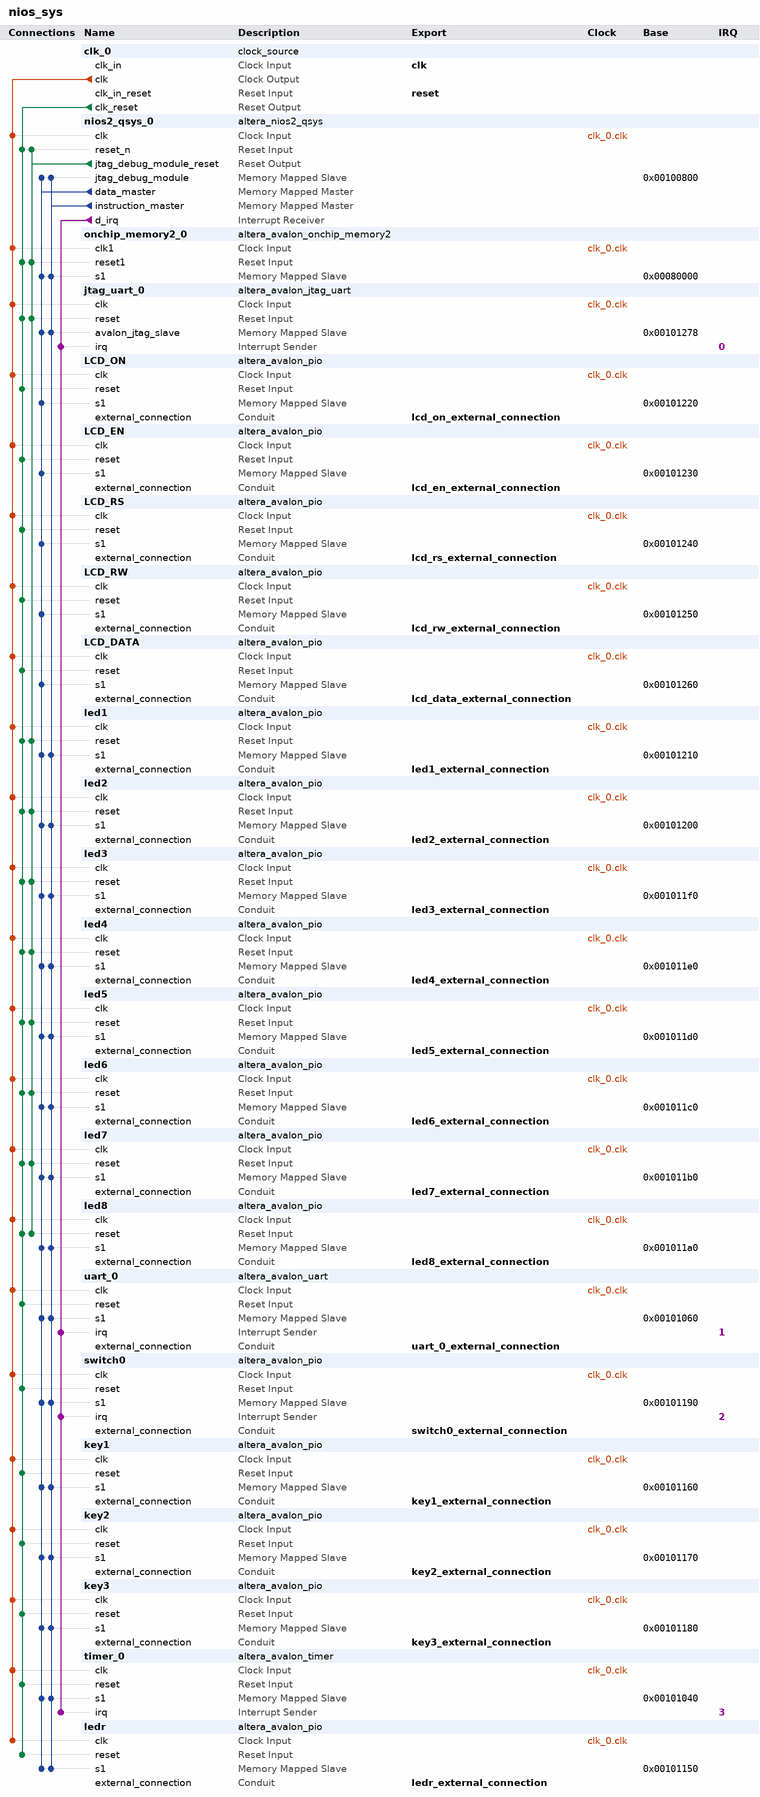
[diagram p0: system contents]
# Platform Designer (Qsys) system nios_sys, Cyclone IV E EP4CE115F29C8
# Parameters at their usual value, and those the tool derives, are not listed.
package require -exact qsys 13.0.1.99.2
create_system nios_sys
set_project_property DEVICE_FAMILY {Cyclone IV E}
set_project_property DEVICE EP4CE115F29C8

add_instance clk_0 clock_source 13.0
set_instance_parameter_value clk_0 clockFrequency 50000000

add_instance nios2_qsys_0 altera_nios2_qsys 13.0
set_instance_parameter_value nios2_qsys_0 resetSlave onchip_memory2_0.s1
set_instance_parameter_value nios2_qsys_0 mmu_TLBMissExcSlave None
set_instance_parameter_value nios2_qsys_0 exceptionSlave onchip_memory2_0.s1
set_instance_parameter_value nios2_qsys_0 breakSlave nios2_qsys_0.jtag_debug_module
set_instance_parameter_value nios2_qsys_0 impl Tiny
set_instance_parameter_value nios2_qsys_0 icache_size 4096

add_instance onchip_memory2_0 altera_avalon_onchip_memory2 13.0.1.99.2
set_instance_parameter_value onchip_memory2_0 dataWidth 32
set_instance_parameter_value onchip_memory2_0 dualPort false
set_instance_parameter_value onchip_memory2_0 initMemContent true
set_instance_parameter_value onchip_memory2_0 initializationFileName onchip_mem.hex
set_instance_parameter_value onchip_memory2_0 memorySize 400000

add_instance jtag_uart_0 altera_avalon_jtag_uart 13.0.1.99.2
set_instance_parameter_value jtag_uart_0 simInteractiveOptions NO_INTERACTIVE_WINDOWS

add_instance LCD_ON altera_avalon_pio 13.0.1.99.2
set_instance_parameter_value LCD_ON direction Output
set_instance_parameter_value LCD_ON width 1

add_instance LCD_EN altera_avalon_pio 13.0.1.99.2
set_instance_parameter_value LCD_EN direction Output
set_instance_parameter_value LCD_EN width 1

add_instance LCD_RS altera_avalon_pio 13.0.1.99.2
set_instance_parameter_value LCD_RS direction Output
set_instance_parameter_value LCD_RS width 1

add_instance LCD_RW altera_avalon_pio 13.0.1.99.2
set_instance_parameter_value LCD_RW direction Output
set_instance_parameter_value LCD_RW width 1

add_instance LCD_DATA altera_avalon_pio 13.0.1.99.2
set_instance_parameter_value LCD_DATA direction Output
set_instance_parameter_value LCD_DATA width 8

add_instance led1 altera_avalon_pio 13.0.1.99.2
set_instance_parameter_value led1 direction Output
set_instance_parameter_value led1 width 8

add_instance led2 altera_avalon_pio 13.0.1.99.2
set_instance_parameter_value led2 direction Output
set_instance_parameter_value led2 width 8

add_instance led3 altera_avalon_pio 13.0.1.99.2
set_instance_parameter_value led3 direction Output
set_instance_parameter_value led3 width 8

add_instance led4 altera_avalon_pio 13.0.1.99.2
set_instance_parameter_value led4 direction Output
set_instance_parameter_value led4 width 8

add_instance led5 altera_avalon_pio 13.0.1.99.2
set_instance_parameter_value led5 direction Output
set_instance_parameter_value led5 width 8

add_instance led6 altera_avalon_pio 13.0.1.99.2
set_instance_parameter_value led6 direction Output
set_instance_parameter_value led6 width 8

add_instance led7 altera_avalon_pio 13.0.1.99.2
set_instance_parameter_value led7 direction Output
set_instance_parameter_value led7 width 8

add_instance led8 altera_avalon_pio 13.0.1.99.2
set_instance_parameter_value led8 direction Output
set_instance_parameter_value led8 width 8

add_instance uart_0 altera_avalon_uart 13.0.1.99.2
set_instance_parameter_value uart_0 baud 9600
set_instance_parameter_value uart_0 dataBits 8
set_instance_parameter_value uart_0 fixedBaud true
set_instance_parameter_value uart_0 parity NONE
set_instance_parameter_value uart_0 stopBits 1

add_instance switch0 altera_avalon_pio 13.0.1.99.2
set_instance_parameter_value switch0 captureEdge true
set_instance_parameter_value switch0 direction Input
set_instance_parameter_value switch0 generateIRQ true
set_instance_parameter_value switch0 irqType EDGE
set_instance_parameter_value switch0 width 2

add_instance key1 altera_avalon_pio 13.0.1.99.2
set_instance_parameter_value key1 direction Input
set_instance_parameter_value key1 width 1

add_instance key2 altera_avalon_pio 13.0.1.99.2
set_instance_parameter_value key2 direction Input
set_instance_parameter_value key2 width 1

add_instance key3 altera_avalon_pio 13.0.1.99.2
set_instance_parameter_value key3 direction Input
set_instance_parameter_value key3 width 1

add_instance timer_0 altera_avalon_timer 13.0.1.99.2
set_instance_parameter_value timer_0 period 1
set_instance_parameter_value timer_0 periodUnits MSEC

add_instance ledr altera_avalon_pio 13.0.1.99.2
set_instance_parameter_value ledr direction Output
set_instance_parameter_value ledr width 8

# connections
add_connection clk_0.clk jtag_uart_0.clk clock
add_connection clk_0.clk key1.clk clock
add_connection clk_0.clk key2.clk clock
add_connection clk_0.clk key3.clk clock
add_connection clk_0.clk LCD_DATA.clk clock
add_connection clk_0.clk LCD_EN.clk clock
add_connection clk_0.clk LCD_ON.clk clock
add_connection clk_0.clk LCD_RS.clk clock
add_connection clk_0.clk LCD_RW.clk clock
add_connection clk_0.clk led1.clk clock
add_connection clk_0.clk led2.clk clock
add_connection clk_0.clk led3.clk clock
add_connection clk_0.clk led4.clk clock
add_connection clk_0.clk led5.clk clock
add_connection clk_0.clk led6.clk clock
add_connection clk_0.clk led7.clk clock
add_connection clk_0.clk led8.clk clock
add_connection clk_0.clk ledr.clk clock
add_connection clk_0.clk nios2_qsys_0.clk clock
add_connection clk_0.clk onchip_memory2_0.clk1 clock
add_connection clk_0.clk switch0.clk clock
add_connection clk_0.clk timer_0.clk clock
add_connection clk_0.clk uart_0.clk clock
add_connection clk_0.clk_reset jtag_uart_0.reset reset
add_connection clk_0.clk_reset key1.reset reset
add_connection clk_0.clk_reset key2.reset reset
add_connection clk_0.clk_reset key3.reset reset
add_connection clk_0.clk_reset LCD_DATA.reset reset
add_connection clk_0.clk_reset LCD_EN.reset reset
add_connection clk_0.clk_reset LCD_ON.reset reset
add_connection clk_0.clk_reset LCD_RS.reset reset
add_connection clk_0.clk_reset LCD_RW.reset reset
add_connection clk_0.clk_reset led1.reset reset
add_connection clk_0.clk_reset led2.reset reset
add_connection clk_0.clk_reset led3.reset reset
add_connection clk_0.clk_reset led4.reset reset
add_connection clk_0.clk_reset led5.reset reset
add_connection clk_0.clk_reset led6.reset reset
add_connection clk_0.clk_reset led7.reset reset
add_connection clk_0.clk_reset led8.reset reset
add_connection clk_0.clk_reset ledr.reset reset
add_connection clk_0.clk_reset nios2_qsys_0.reset_n reset
add_connection clk_0.clk_reset onchip_memory2_0.reset1 reset
add_connection clk_0.clk_reset switch0.reset reset
add_connection clk_0.clk_reset timer_0.reset reset
add_connection clk_0.clk_reset uart_0.reset reset
add_connection nios2_qsys_0.jtag_debug_module_reset jtag_uart_0.reset reset
add_connection nios2_qsys_0.jtag_debug_module_reset led1.reset reset
add_connection nios2_qsys_0.jtag_debug_module_reset led2.reset reset
add_connection nios2_qsys_0.jtag_debug_module_reset led3.reset reset
add_connection nios2_qsys_0.jtag_debug_module_reset led4.reset reset
add_connection nios2_qsys_0.jtag_debug_module_reset led5.reset reset
add_connection nios2_qsys_0.jtag_debug_module_reset led6.reset reset
add_connection nios2_qsys_0.jtag_debug_module_reset led7.reset reset
add_connection nios2_qsys_0.jtag_debug_module_reset led8.reset reset
add_connection nios2_qsys_0.jtag_debug_module_reset nios2_qsys_0.reset_n reset
add_connection nios2_qsys_0.jtag_debug_module_reset onchip_memory2_0.reset1 reset
add_connection nios2_qsys_0.data_master jtag_uart_0.avalon_jtag_slave avalon
set_connection_parameter_value nios2_qsys_0.data_master/jtag_uart_0.avalon_jtag_slave baseAddress 0x00101278
add_connection nios2_qsys_0.data_master key1.s1 avalon
set_connection_parameter_value nios2_qsys_0.data_master/key1.s1 baseAddress 0x00101160
add_connection nios2_qsys_0.data_master key2.s1 avalon
set_connection_parameter_value nios2_qsys_0.data_master/key2.s1 baseAddress 0x00101170
add_connection nios2_qsys_0.data_master key3.s1 avalon
set_connection_parameter_value nios2_qsys_0.data_master/key3.s1 baseAddress 0x00101180
add_connection nios2_qsys_0.data_master LCD_DATA.s1 avalon
set_connection_parameter_value nios2_qsys_0.data_master/LCD_DATA.s1 baseAddress 0x00101260
add_connection nios2_qsys_0.data_master LCD_EN.s1 avalon
set_connection_parameter_value nios2_qsys_0.data_master/LCD_EN.s1 baseAddress 0x00101230
add_connection nios2_qsys_0.data_master LCD_ON.s1 avalon
set_connection_parameter_value nios2_qsys_0.data_master/LCD_ON.s1 baseAddress 0x00101220
add_connection nios2_qsys_0.data_master LCD_RS.s1 avalon
set_connection_parameter_value nios2_qsys_0.data_master/LCD_RS.s1 baseAddress 0x00101240
add_connection nios2_qsys_0.data_master LCD_RW.s1 avalon
set_connection_parameter_value nios2_qsys_0.data_master/LCD_RW.s1 baseAddress 0x00101250
add_connection nios2_qsys_0.data_master led1.s1 avalon
set_connection_parameter_value nios2_qsys_0.data_master/led1.s1 baseAddress 0x00101210
add_connection nios2_qsys_0.data_master led2.s1 avalon
set_connection_parameter_value nios2_qsys_0.data_master/led2.s1 baseAddress 0x00101200
add_connection nios2_qsys_0.data_master led3.s1 avalon
set_connection_parameter_value nios2_qsys_0.data_master/led3.s1 baseAddress 0x001011f0
add_connection nios2_qsys_0.data_master led4.s1 avalon
set_connection_parameter_value nios2_qsys_0.data_master/led4.s1 baseAddress 0x001011e0
add_connection nios2_qsys_0.data_master led5.s1 avalon
set_connection_parameter_value nios2_qsys_0.data_master/led5.s1 baseAddress 0x001011d0
add_connection nios2_qsys_0.data_master led6.s1 avalon
set_connection_parameter_value nios2_qsys_0.data_master/led6.s1 baseAddress 0x001011c0
add_connection nios2_qsys_0.data_master led7.s1 avalon
set_connection_parameter_value nios2_qsys_0.data_master/led7.s1 baseAddress 0x001011b0
add_connection nios2_qsys_0.data_master led8.s1 avalon
set_connection_parameter_value nios2_qsys_0.data_master/led8.s1 baseAddress 0x001011a0
add_connection nios2_qsys_0.data_master ledr.s1 avalon
set_connection_parameter_value nios2_qsys_0.data_master/ledr.s1 baseAddress 0x00101150
add_connection nios2_qsys_0.data_master nios2_qsys_0.jtag_debug_module avalon
set_connection_parameter_value nios2_qsys_0.data_master/nios2_qsys_0.jtag_debug_module baseAddress 0x00100800
add_connection nios2_qsys_0.data_master onchip_memory2_0.s1 avalon
set_connection_parameter_value nios2_qsys_0.data_master/onchip_memory2_0.s1 baseAddress 0x00080000
add_connection nios2_qsys_0.data_master switch0.s1 avalon
set_connection_parameter_value nios2_qsys_0.data_master/switch0.s1 baseAddress 0x00101190
add_connection nios2_qsys_0.data_master timer_0.s1 avalon
set_connection_parameter_value nios2_qsys_0.data_master/timer_0.s1 baseAddress 0x00101040
add_connection nios2_qsys_0.data_master uart_0.s1 avalon
set_connection_parameter_value nios2_qsys_0.data_master/uart_0.s1 baseAddress 0x00101060
add_connection nios2_qsys_0.instruction_master jtag_uart_0.avalon_jtag_slave avalon
set_connection_parameter_value nios2_qsys_0.instruction_master/jtag_uart_0.avalon_jtag_slave baseAddress 0x00101278
add_connection nios2_qsys_0.instruction_master key1.s1 avalon
set_connection_parameter_value nios2_qsys_0.instruction_master/key1.s1 baseAddress 0x00101160
add_connection nios2_qsys_0.instruction_master key2.s1 avalon
set_connection_parameter_value nios2_qsys_0.instruction_master/key2.s1 baseAddress 0x00101170
add_connection nios2_qsys_0.instruction_master key3.s1 avalon
set_connection_parameter_value nios2_qsys_0.instruction_master/key3.s1 baseAddress 0x00101180
add_connection nios2_qsys_0.instruction_master led1.s1 avalon
set_connection_parameter_value nios2_qsys_0.instruction_master/led1.s1 baseAddress 0x00101210
add_connection nios2_qsys_0.instruction_master led2.s1 avalon
set_connection_parameter_value nios2_qsys_0.instruction_master/led2.s1 baseAddress 0x00101200
add_connection nios2_qsys_0.instruction_master led3.s1 avalon
set_connection_parameter_value nios2_qsys_0.instruction_master/led3.s1 baseAddress 0x001011f0
add_connection nios2_qsys_0.instruction_master led4.s1 avalon
set_connection_parameter_value nios2_qsys_0.instruction_master/led4.s1 baseAddress 0x001011e0
add_connection nios2_qsys_0.instruction_master led5.s1 avalon
set_connection_parameter_value nios2_qsys_0.instruction_master/led5.s1 baseAddress 0x001011d0
add_connection nios2_qsys_0.instruction_master led6.s1 avalon
set_connection_parameter_value nios2_qsys_0.instruction_master/led6.s1 baseAddress 0x001011c0
add_connection nios2_qsys_0.instruction_master led7.s1 avalon
set_connection_parameter_value nios2_qsys_0.instruction_master/led7.s1 baseAddress 0x001011b0
add_connection nios2_qsys_0.instruction_master led8.s1 avalon
set_connection_parameter_value nios2_qsys_0.instruction_master/led8.s1 baseAddress 0x001011a0
add_connection nios2_qsys_0.instruction_master ledr.s1 avalon
set_connection_parameter_value nios2_qsys_0.instruction_master/ledr.s1 baseAddress 0x00101150
add_connection nios2_qsys_0.instruction_master nios2_qsys_0.jtag_debug_module avalon
set_connection_parameter_value nios2_qsys_0.instruction_master/nios2_qsys_0.jtag_debug_module baseAddress 0x00100800
add_connection nios2_qsys_0.instruction_master onchip_memory2_0.s1 avalon
set_connection_parameter_value nios2_qsys_0.instruction_master/onchip_memory2_0.s1 baseAddress 0x00080000
add_connection nios2_qsys_0.instruction_master switch0.s1 avalon
set_connection_parameter_value nios2_qsys_0.instruction_master/switch0.s1 baseAddress 0x00101190
add_connection nios2_qsys_0.instruction_master timer_0.s1 avalon
set_connection_parameter_value nios2_qsys_0.instruction_master/timer_0.s1 baseAddress 0x00101040
add_connection nios2_qsys_0.instruction_master uart_0.s1 avalon
set_connection_parameter_value nios2_qsys_0.instruction_master/uart_0.s1 baseAddress 0x00101060
add_connection nios2_qsys_0.d_irq jtag_uart_0.irq interrupt
set_connection_parameter_value nios2_qsys_0.d_irq/jtag_uart_0.irq irqNumber 0
add_connection nios2_qsys_0.d_irq switch0.irq interrupt
set_connection_parameter_value nios2_qsys_0.d_irq/switch0.irq irqNumber 2
add_connection nios2_qsys_0.d_irq timer_0.irq interrupt
set_connection_parameter_value nios2_qsys_0.d_irq/timer_0.irq irqNumber 3
add_connection nios2_qsys_0.d_irq uart_0.irq interrupt
set_connection_parameter_value nios2_qsys_0.d_irq/uart_0.irq irqNumber 1

# exported interfaces
add_interface clk clock sink
set_interface_property clk EXPORT_OF clk_0.clk_in
add_interface reset reset sink
set_interface_property reset EXPORT_OF clk_0.clk_in_reset
add_interface lcd_data_external_connection conduit end
set_interface_property lcd_data_external_connection EXPORT_OF LCD_DATA.external_connection
add_interface lcd_rw_external_connection conduit end
set_interface_property lcd_rw_external_connection EXPORT_OF LCD_RW.external_connection
add_interface lcd_rs_external_connection conduit end
set_interface_property lcd_rs_external_connection EXPORT_OF LCD_RS.external_connection
add_interface lcd_en_external_connection conduit end
set_interface_property lcd_en_external_connection EXPORT_OF LCD_EN.external_connection
add_interface lcd_on_external_connection conduit end
set_interface_property lcd_on_external_connection EXPORT_OF LCD_ON.external_connection
add_interface led8_external_connection conduit end
set_interface_property led8_external_connection EXPORT_OF led8.external_connection
add_interface led7_external_connection conduit end
set_interface_property led7_external_connection EXPORT_OF led7.external_connection
add_interface led6_external_connection conduit end
set_interface_property led6_external_connection EXPORT_OF led6.external_connection
add_interface led5_external_connection conduit end
set_interface_property led5_external_connection EXPORT_OF led5.external_connection
add_interface led4_external_connection conduit end
set_interface_property led4_external_connection EXPORT_OF led4.external_connection
add_interface led3_external_connection conduit end
set_interface_property led3_external_connection EXPORT_OF led3.external_connection
add_interface led2_external_connection conduit end
set_interface_property led2_external_connection EXPORT_OF led2.external_connection
add_interface led1_external_connection conduit end
set_interface_property led1_external_connection EXPORT_OF led1.external_connection
add_interface uart_0_external_connection conduit end
set_interface_property uart_0_external_connection EXPORT_OF uart_0.external_connection
add_interface switch0_external_connection conduit end
set_interface_property switch0_external_connection EXPORT_OF switch0.external_connection
add_interface key3_external_connection conduit end
set_interface_property key3_external_connection EXPORT_OF key3.external_connection
add_interface key2_external_connection conduit end
set_interface_property key2_external_connection EXPORT_OF key2.external_connection
add_interface key1_external_connection conduit end
set_interface_property key1_external_connection EXPORT_OF key1.external_connection
add_interface ledr_external_connection conduit end
set_interface_property ledr_external_connection EXPORT_OF ledr.external_connection

set_interconnect_requirement {$system} qsys_mm.clockCrossingAdapter HANDSHAKE
set_interconnect_requirement {$system} qsys_mm.maxAdditionalLatency 1

save_system nios_sys.qsys
